# EAGLE design ftcontrol (EAGLE 6.4)
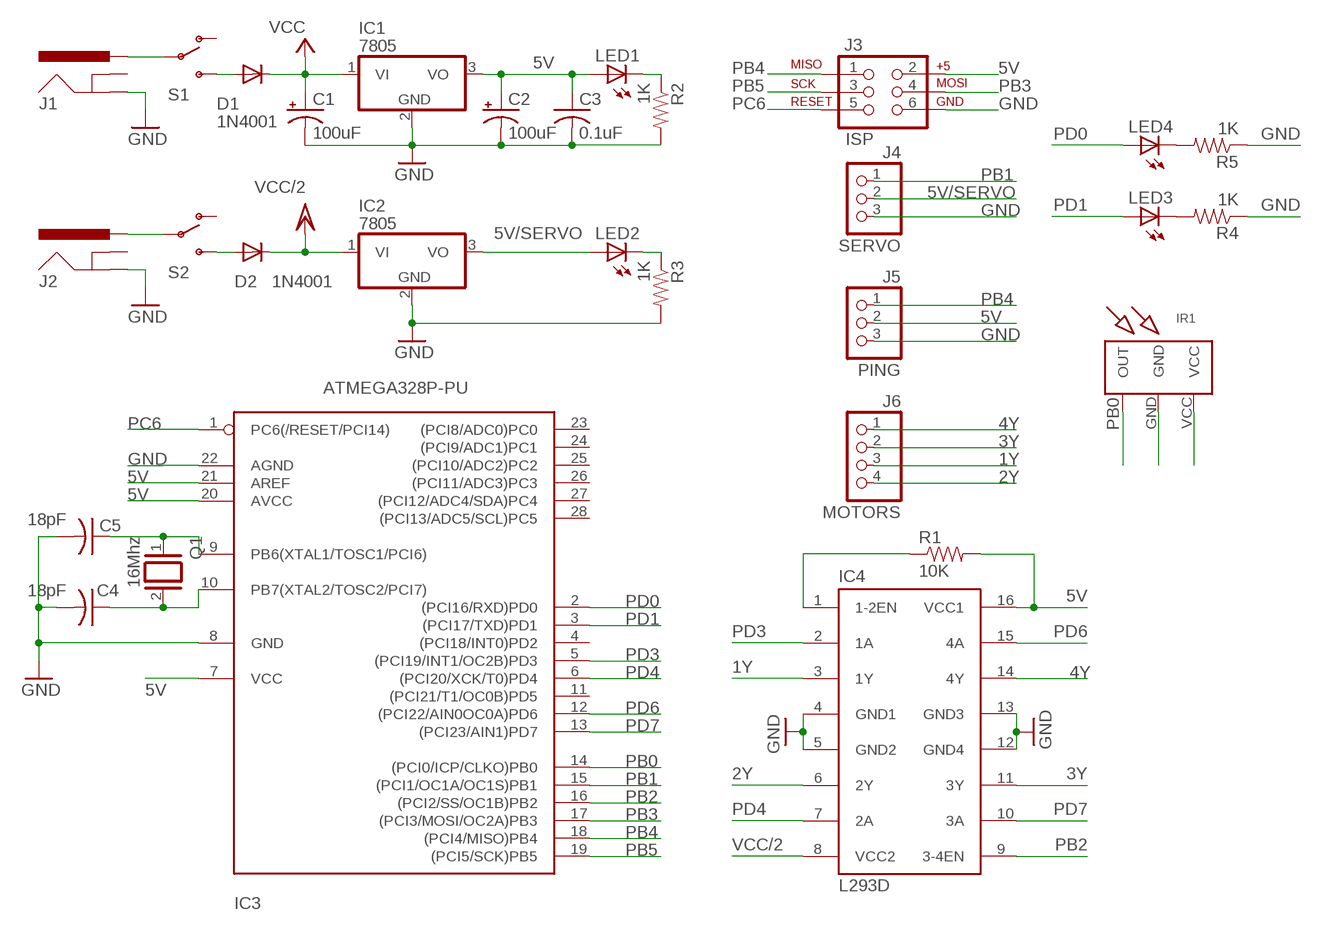
[diagram p0: schematic, sheet 1]

## Parts
C1  100uF  CAP_POLPTH1  [CPOL-RADIAL-100UF-25V]
C2  100uF  CAP_POLPTH2  [CPOL-RADIAL-10UF-25V]
C3  0.1uF  C-US025-025X050  [C025-025X050]
C4  18pF  C-US025-025X050  [C025-025X050]
C5  18pF  C-US025-025X050  [C025-025X050]
D1  1N4001  DIODEPTH  [DIODE-1N4001]
D2  1N4001  DIODEPTH  [DIODE-1N4001]
IC1  7805  7805TV  [TO220V]
IC2  7805  7805TV  [TO220V]
IC3  ATMEGA328P-PU  ATMEGA168-20P  [DIL28-3]
IC4  L293D  [DIL16]
IR1  IR_TSOP4838  [TSOP_4838]
J1  POWER_JACKPTH  [POWER_JACK_PTH]
J2  POWER_JACKPTH  [POWER_JACK_PTH]
J3  ISP  AVR_SPI_PRG_6PTH  [2X3]
J4  SERVO  PINHD-1X3  [1X03]
J5  PING  PINHD-1X3  [1X03]
J6  MOTORS  PINHD-1X4  [1X04]
LED1  LED3MM  [LED3MM]
LED2  LED3MM  [LED3MM]
LED3  LED3MM  [LED3MM]
LED4  LED3MM  [LED3MM]
Q1  16Mhz  XTAL/S  [QS]
R1  10K  RESISTORPTH-1/4W  [AXIAL-0.4]
R2  1K  RESISTORPTH-1/4W  [AXIAL-0.4]
R3  1K  RESISTORPTH-1/4W  [AXIAL-0.4]
R4  1K  RESISTORPTH-1/4W  [AXIAL-0.4]
R5  1K  RESISTORPTH-1/4W  [AXIAL-0.4]
S1  SWITCH-SPDTPTH  [SWITCH-SPDT]
S2  SWITCH-SPDTPTH  [SWITCH-SPDT]

## Nets
1Y: IC4.3(1Y) J6.3
2Y: IC4.6(2Y) J6.4
3Y: IC4.11(3Y) J6.2
4Y: IC4.14(4Y) J6.1
5V: C2.1(+) C3.1 IC1.3(VO) IC3.7(VCC) IC3.20(AVCC) IC3.21(AREF) IC4.16(VCC1) IR1.VCC J3.2 J5.2 LED1.A R1.P$2
5V/SERVO: IC2.3(VO) J4.2 LED2.A
GND: C1.2(-) C2.2(-) C3.2 C4.2 C5.2 IC1.2(GND) IC2.2(GND) IC3.8(GND) IC3.22(AGND) IC4.4(GND1) IC4.5(GND2) IC4.12(GND4) IC4.13(GND3) IR1.GND J1.GND J2.GND J3.6 J4.3 J5.3 R2.P$2 R3.P$2 R4.P$1 R5.P$1
N$1: LED1.K(C) R2.P$1
N$3: D1.A S1.3(S)
N$4: LED3.K(C) R4.P$2
N$5: J2.PWR S2.2(P)
N$6: IC4.1(1-2EN) R1.P$1
N$7: LED2.K(C) R3.P$1
N$8: D2.A S2.3(S)
N$9: LED4.K(C) R5.P$2
N$11: C5.1 IC3.9(PB6(XTAL1/TOSC1/PCI6)) Q1.1
N$12: C4.1 IC3.10(PB7(XTAL2/TOSC2/PCI7)) Q1.2
N$13: J1.PWR S1.2(P)
PB0: IC3.14((PCI0/ICP/CLKO)PB0) IR1.OUT
PB1: IC3.15((PCI1/OC1A/OC1S)PB1) J4.1
PB2: IC3.16((PCI2/SS/OC1B)PB2) IC4.9(3-4EN)
PB3: IC3.17((PCI3/MOSI/OC2A)PB3) J3.4
PB4: IC3.18((PCI4/MISO)PB4) J3.1 J5.1
PB5: IC3.19((PCI5/SCK)PB5) J3.3
PC6: IC3.1(PC6(/RESET/PCI14)) J3.5
PD0: IC3.2((PCI16/RXD)PD0) LED4.A
PD1: IC3.3((PCI17/TXD)PD1) LED3.A
PD3: IC3.5((PCI19/INT1/OC2B)PD3) IC4.2(1A)
PD4: IC3.6((PCI20/XCK/T0)PD4) IC4.7(2A)
PD6: IC3.12((PCI22/AIN0OC0A)PD6) IC4.15(4A)
PD7: IC3.13((PCI23/AIN1)PD7) IC4.10(3A)
VCC: C1.1(+) D1.C IC1.1(VI)
VCC/2: D2.C IC2.1(VI) IC4.8(VCC2)
Unconnected: IC3.4((PCI18/INT0)PD2) IC3.11((PCI21/T1/OC0B)PD5) IC3.23((PCI8/ADC0)PC0) IC3.24((PCI9/ADC1)PC1) IC3.25((PCI10/ADC2)PC2) IC3.26((PCI11/ADC3)PC3) IC3.27((PCI12/ADC4/SDA)PC4) IC3.28((PCI13/ADC5/SCL)PC5) J1.GNDBREAK J2.GNDBREAK S1.1(O) S2.1(O)

## Library data of the parts
C1 C2 = SparkFun-Passives:CAP_POL: Capacitor Polarized These are standard SMD and PTH capacitors. Normally 10uF, 47uF, and 100uF in electrolytic and tantalum varieties. Always verify the external diameter of the through hole cap, it varies with capacity, voltage, and manufacturer. The EIA devices should be standard.
C3-C5 = rcl:C-US: CAPACITOR, American symbol
D1 D2 = SparkFun-DiscreteSemi:DIODE: Diode These are standard reverse protection diodes and small signal diodes. SMA package can handle up to about 1A. SOD-323 can handle about 200mA. What the SOD-323 package when ordering, there are some mfgs out there that are 5-pin packages.
IC1 IC2 = linear:78*: Positive VOLTAGE REGULATOR Source: http://cache.national.com/ds/LM/LM78L05.pdf http://www.fairchildsemi.com/ds/LM/LM7805.pdf
IC3 = adafruit:ATMEGA168*P: MICROCONTROLLER 16 kBytes FLASH 1 kBytes SRAM 512 Bytes EEPROM USART 8-channel 10 bit ADC
IC4 = st-microelectronics:L293D: PUSH-PULL 4 CHANNEL DRIVER; MPN: L293D; OC_FARNELL: 9589619; OC_NEWARK: 56P8249
IR1 = ubiyubix:IR_TSOP4838: IR Receiver and Decoder TSOP4838
J1 J2 = SparkFun-Connectors:POWER_JACK: Power Jack This is the standard 5.5mm barrel jack for power. The PTH is the most common, proven, reliable, footprint. All others are experimental. The Slot footprint only works if the mill layer is transmitted to the PCB fab house so be warned. Spark Fun Electronics SKU : PRT-00119. Mating wall wart : TOL-00298 (and others)
J3 = SparkFun-Connectors:AVR_SPI_PRG_6: AVR ISP 6 Pin This is the reduced ISP connector for AVR programming. Common on Arduino. This footprint will take up less PCB space and can be used with a 10-pin to 6-pin adapter such as SKU: BOB-08508
J4 J5 = adafruit:PINHD-1X3: PIN HEADER
J6 = pinhead:PINHD-1X4: PIN HEADER
LED1-LED4 = adafruit:LED: LED OSRAM: - CHIPLED LG R971, LG N971, LY N971, LG Q971, LY Q971, LO R971, LY R971 LH N974, LH R974 LS Q976, LO Q976, LY Q976 LO Q996 - Hyper CHIPLED LW Q18S LB Q993, LB Q99A, LB R99A - SideLED LS A670, LO A670, LY A670, LG A670, LP A670 LB A673, LV A673, LT A673, LW A673 LH A674 LY A675 LS A676, LA A676, LO A676, LY A676, LW A676 LS A679, LY A679, LG A679 - Hyper Micro SIDELED® LS Y876, LA Y876, LO Y876, LY Y876 LT Y87S - SmartLED LW L88C, LW L88S LB L89C, LB L89S, LG L890 LS L89K, LO L89K, LY L89K LS L896, LA L896, LO L896, LY L896 - TOPLED LS T670, LO T670, LY T670, LG T670, LP T670 LSG T670, LSP T670, LSY T670, LOP T670, LYG T670 LG T671, LOG T671, LSG T671 LB T673, LV T673, LT T673, LW T673 LH T674 LS T676, LA T676, LO T676, LY T676, LB T676, LH T676, LSB T676, LW T676 LB T67C, LV T67C, LT T67C, LS T67K, LO T67K, LY T67K, LW E67C LS E67B, LA E67B, LO E67B, LY E67B, LB E67C, LV E67C, LT E67C LW T67C LS T679, LY T679, LG T679 LS T770, LO T770, LY T770, LG T770, LP T770 LB T773, LV T773, LT T773, LW T773 LH T774 LS E675, LA E675, LY E675, LS T675 LS T776, LA T776, LO T776, LY T776, LB T776 LHGB T686 LT T68C, LB T68C - Hyper Mini TOPLED® LB M676 - Mini TOPLED Santana® LG M470 LS M47K, LO M47K, LY M47K Source: http://www.osram.convergy.de/
Q1 = SmartPrj:XTAL/S: CRYSTAL
R1-R5 = SparkFun-Resistors:RESISTOR: Resistor Basic schematic elements and footprints for 0603, 1206, and PTH resistors.
S1 S2 = SparkFun-Electromechanical:SWITCH-SPDT: SPST Switch Simple slide switch. Spark Fun Electronics SKU : COM-00102

## Board
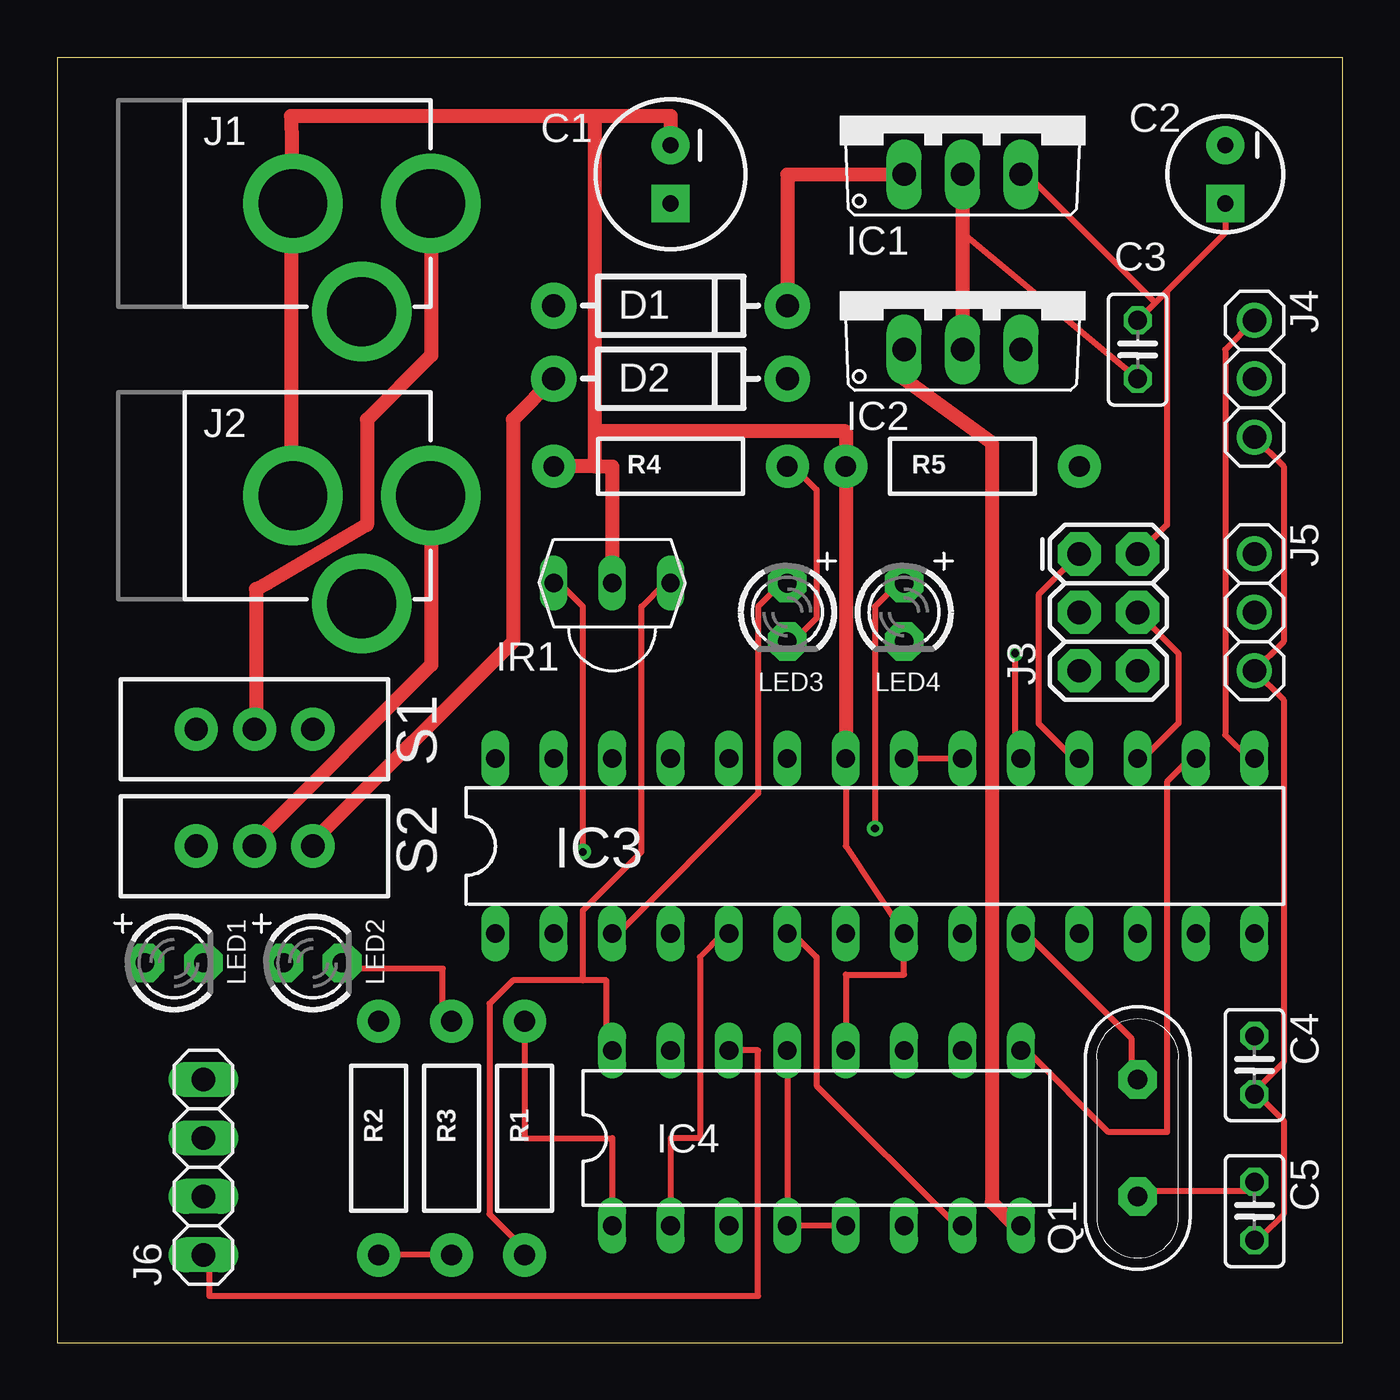
[diagram p1: board, top side]
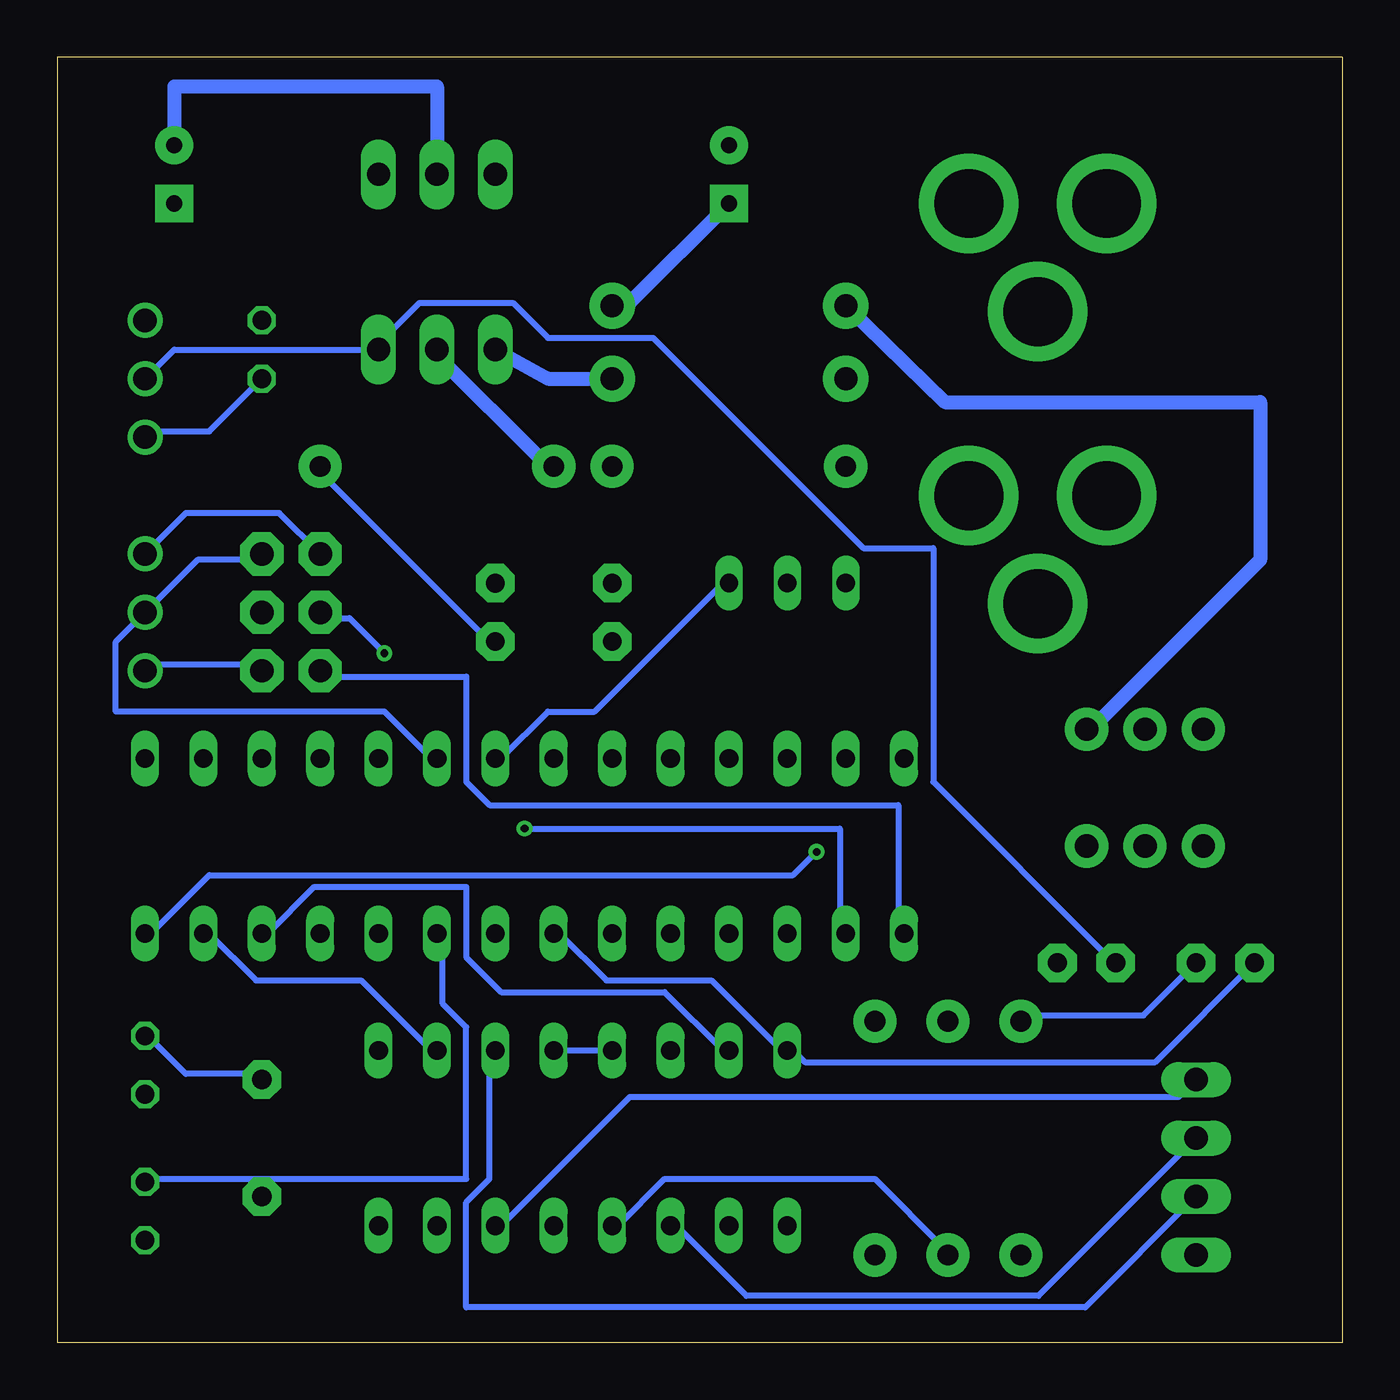
[diagram p2: board, bottom side, seen from below]

Size 55.88 x 55.88 mm. Coordinates in mm from the lower left corner, seen from the top.
Outline: 0,55.88 0,0 55.88,0 55.88,55.88 0,55.88
Copper layers (1*16): Top 0.0356mm / dielectric 1.5011mm / Bottom 0.0356mm
Design rules "LaenPCBOrder *": minimum track width 10mil, minimum drill 13mil, track to track 10mil, track to pad 10mil, pad to pad 10mil, via to via 10mil, smd to smd 10mil, copper to edge 15mil, drill to drill 6mil, minimum pad ring 7mil, minimum via ring 7mil, stop-mask expansion 4mil, vias tented up to drill 0mil, thermal gap 10mil

### Footprints (pad centres in the part's own frame; a part is rotated, then mirrored left to right if it is on the bottom)
CPOL-RADIAL-100UF-25V = drill 0.7 pad 1.651 square: 1 1.27,0 | drill 0.7 pad 1.651: 2 -1.27,0
CPOL-RADIAL-10UF-25V = drill 0.7 pad 1.651 square: 1 1.27,0 | drill 0.7 pad 1.651: 2 -1.27,0
C025-025X050 = drill 0.813 octagon: 1 -1.27,0; 2 1.27,0
DIODE-1N4001 = drill 1 pad 1.981: A -5.08,0; C 5.08,0
TO220V = drill 1.016 long: 1 -2.54,-2.54; 2 0,-2.54; 3 2.54,-2.54
DIL28-3 = drill 0.813 long: 1 -16.51,-3.81; 2 -13.97,-3.81; 3 -11.43,-3.81; 4 -8.89,-3.81; 5 -6.35,-3.81; 6 -3.81,-3.81; 7 -1.27,-3.81; 8 1.27,-3.81; 9 3.81,-3.81; 10 6.35,-3.81; 11 8.89,-3.81; 12 11.43,-3.81; 13 13.97,-3.81; 14 16.51,-3.81; 15 16.51,3.81; 16 13.97,3.81; 17 11.43,3.81; 18 8.89,3.81; 19 6.35,3.81; 20 3.81,3.81; 21 1.27,3.81; 22 -1.27,3.81; 23 -3.81,3.81; 24 -6.35,3.81; 25 -8.89,3.81; 26 -11.43,3.81; 27 -13.97,3.81; 28 -16.51,3.81
DIL16 = drill 0.813 long: 1 -8.89,-3.81; 2 -6.35,-3.81; 3 -3.81,-3.81; 4 -1.27,-3.81; 5 1.27,-3.81; 6 3.81,-3.81; 7 6.35,-3.81; 8 8.89,-3.81; 9 8.89,3.81; 10 6.35,3.81; 11 3.81,3.81; 12 1.27,3.81; 13 -1.27,3.81; 14 -3.81,3.81; 15 -6.35,3.81; 16 -8.89,3.81
TSOP_4838 = drill 0.8 long: GND 0,0; OUT -2.54,0; VCC 2.54,0
POWER_JACK_PTH = drill 2.997 pad 4.318: GND 0,7.7; GNDBREAK 4.7,10.7; PWR 0,13.7
2X3 = drill 1.016 pad 1.88 octagon: 1 0,0; 2 0,2.54; 3 2.54,0; 4 2.54,2.54; 5 5.08,0; 6 5.08,2.54
1X03 = drill 1.016: 1 -2.54,0; 2 0,0; 3 2.54,0
1X04 = drill 1.016 long: 1 -3.81,0; 2 -1.27,0; 3 1.27,0; 4 3.81,0
LED3MM = drill 0.813 pad 1.676 octagon: A -1.27,0; K 1.27,0
QS = drill 0.85 pad 1.676 octagon: 1 -2.54,0; 2 2.54,0
AXIAL-0.4 = drill 0.9 pad 1.88: P$1 -5.08,0; P$2 5.08,0
SWITCH-SPDT = drill 1.016 pad 1.88: 1 0,2.54; 2 0,0; 3 0,-2.54

### Placement (x,y rotation side)
C1  26.67,50.8 270 top
C2  50.8,50.8 270 top
C3  46.99,43.18 270 top
C4  52.07,12.06 270 top
C5  52.07,5.71 270 top
D1  26.67,45.08 0 top
D2  26.67,41.91 0 top
IC1  39.37,53.34 0 top
IC2  39.37,45.72 0 top
IC3  35.56,21.59 0 top
IC4  33.02,8.89 0 top
IR1  24.13,33.02 0 top
J1  2.54,49.53 270 top
J2  2.54,36.83 270 top
J3  44.45,34.29 270 top
J4  52.07,41.91 270 top
J5  52.07,31.75 270 top
J6  6.35,7.62 90 top
LED1  5.08,16.51 0 top
LED2  11.11,16.51 0 top
LED3  31.75,31.75 270 top
LED4  36.83,31.75 270 top
Q1  46.99,8.89 90 top
R1  20.32,8.89 270 top
R2  13.97,8.89 270 top
R3  17.14,8.89 270 top
R4  26.67,38.1 0 top
R5  39.37,38.1 0 top
S1  8.57,26.67 90 top
S2  8.57,21.59 90 top

### Tracks (layer width: path | path; a pad name or v marks a point on that pad's centre or on a via)
1Y
  Bottom 0.254: J6.3 13.21,2.03 25.91,2.03 28.96,5.08 IC4.3
2Y
  Bottom 0.254: J6.4 7.11,10.67 30.99,10.67 36.58,5.08 IC4.6
3Y
  Bottom 0.254: J6.2 11.18,1.52 38.1,1.52 38.1,6.1 37.08,7.11 37.08,12.7 IC4.11
4Y
  Top 0.254: IC4.14 30.48,12.7 30.48,2.03 6.6,2.03 6.6,3.56 J6.1
5V
  Top 0.254: 48.26,45.72 50.8,48.26 C2.1 | 48.26,45.72 47.75,45.21 | 47.75,45.21 C3.1 | 47.75,45.21 42.16,50.8 IC1.3 | J3.2 48.26,35.56 48.26,45.72 | IC3.21 IC3.20 | 22.86,15.75 23.88,15.75 23.88,12.7 IC4.16 | 22.86,15.75 19.81,15.75 18.8,14.73 18.8,5.59 20.32,4.06 R1.P$2 | 22.86,15.75 22.86,18.8 25.4,21.34 25.4,32 26.42,33.02 IR1.VCC
  Bottom 0.254: J3.2 47.24,34.04 49.78,34.04 J5.2 53.34,30.48 53.34,27.43 41.66,27.43 39.62,25.4 IC3.20 | IR1.VCC 26.92,33.02 32.51,27.43 34.54,27.43 36.58,25.4 IC3.21 | IC3.7 34.04,17.78 32,15.75 27.43,15.75 24.38,12.7 IC4.16 23.88,12.7 23.37,12.19 8.13,12.19 LED1.A
5V/SERVO
  Bottom 0.254: 42.16,43.18 50.8,43.18 J4.2 | 42.16,43.18 40.13,45.21 36.07,45.21 34.54,43.69 29.97,43.69 20.83,34.54 17.78,34.54 17.78,24.38 10.16,16.76 LED2.A | 42.16,43.18 IC2.3
GND
  Top 0.254: 10.16,37.08 J2.GND | 10.16,49.28 J1.GND | R3.P$2 R2.P$2 | IC4.5 IC4.4 IC4.13 | IC4.12 34.29,16 36.83,16 IC3.8 34.29,21.59 IC3.22 | C5.2 52.32,4.57 53.34,5.59 53.34,9.65 52.32,10.67 C4.2 52.32,11.18 53.34,12.19 53.34,27.94 J5.3 53.34,30.48 53.34,38.1 J4.3 | 39.37,48.26 C3.2
  Top 0.61: 23.37,38.1 24.13,38.1 IR1.GND | 23.37,53.34 10.16,53.34 J1.GND | 23.37,53.34 26.67,53.34 C1.2 | 23.37,39.62 23.37,38.1 | 23.37,53.34 23.37,39.62 | 23.37,38.1 R4.P$1 | 10.16,49.28 10.16,37.08 | IC3.22 R5.P$1 34.29,39.62 23.37,39.62 | IC1.2 39.37,48.26 IC2.2
  Bottom 0.254: IC4.12 IC4.13 | R3.P$2 17.27,4.06 20.32,7.11 29.46,7.11 31.5,5.08 IC4.4 | J5.3 51.82,29.46 47.24,29.46 J3.6 | C3.2 49.28,39.62 51.82,39.62 J4.3 | 34.54,38.1 R5.P$1 | 39.62,43.18 IC2.2
  Bottom 0.61: C2.2 50.8,54.61 39.37,54.61 IC1.2 | 39.62,43.18 34.54,38.1
N$1
  Bottom 0.254: LED1.K 8.64,14.22 13.72,14.22 R2.P$1
N$3
  Bottom 0.61: D1.A 17.27,40.89 3.56,40.89 3.56,34.04 10.67,26.92 S1.3
N$4
  Top 0.254: LED3.K 32,30.48 33.02,31.5 33.02,37.08 32,38.1 R4.P$2
N$5
  Top 0.254: 8.64,21.84 S2.2 | 16.26,36.58 J2.PWR
  Top 0.61: 8.64,21.84 16.26,29.46 16.26,36.58
N$6
  Top 0.254: R1.P$1 20.32,8.89 24.13,8.89 IC4.1
N$7
  Top 0.254: LED2.K 12.7,16.26 16.76,16.26 16.76,14.22 R3.P$1
N$8
  Top 0.61: D2.A 19.81,40.13 19.81,30.48 11.18,21.84 S2.3
N$9
  Bottom 0.254: LED4.K 37.08,30.48 44.7,38.1 R5.P$2
N$11
  Top 0.254: C5.1 51.82,6.6 47.24,6.6 Q1.1
  Bottom 0.254: IC3.9 39.12,17.78 39.12,14.73 38.1,13.72 38.1,7.11 51.82,7.11 C5.1
N$12
  Top 0.254: IC3.10 42.16,17.78 46.74,13.21 46.74,11.68 Q1.2
  Bottom 0.254: C4.1 51.82,13.21 50.29,11.68 47.24,11.68 Q1.2
N$13
  Top 0.61: S1.2 8.64,26.92 8.64,32.77 9.14,33.02 13.46,35.56 13.46,40.13 16.26,42.93 16.26,49.28 J1.PWR
PB0  (via drill 0.33)
  Top 0.254: v22.86,21.34 22.86,32 21.84,33.02 IR1.OUT
  Bottom 0.254: v22.86,21.34 23.88,20.32 49.28,20.32 51.82,17.78 IC3.14
PB1
  Top 0.254: J4.1 50.8,43.18 50.8,26.42 51.82,25.4 IC3.15
PB2
  Top 0.254: IC4.9 42.16,12.7 45.72,9.14 48.26,9.14 48.26,24.38 49.28,25.4 IC3.16
PB3
  Top 0.254: J3.4 48.77,29.97 48.77,26.92 47.24,25.4 IC3.17
PB4
  Top 0.254: J3.1 42.67,32.51 42.67,26.92 44.2,25.4 IC3.18
  Bottom 0.254: J5.1 50.29,36.07 46.23,36.07 J3.1
PB5  (via drill 0.33)
  Top 0.254: v41.66,29.97 41.66,25.4 IC3.19
  Bottom 0.254: v41.66,29.97 43.18,31.5 44.2,31.5 J3.3
PC6
  Bottom 0.254: IC3.1 19.3,17.78 19.3,23.37 37.08,23.37 38.1,24.38 38.1,28.96 44.2,28.96 J3.5
PD0  (via drill 0.33)
  Top 0.254: v35.56,22.35 35.56,32 36.58,33.02 LED4.A
  Bottom 0.254: v35.56,22.35 21.84,22.35 21.84,17.78 IC3.2
PD1
  Top 0.254: IC3.3 24.38,17.78 30.48,23.88 30.48,32 31.5,33.02 LED3.A
PD3
  Top 0.254: IC4.2 26.67,8.89 27.94,8.89 27.94,16.76 28.96,17.78 IC3.5
PD4
  Top 0.254: IC4.7 39.12,5.08 33.02,11.18 33.02,16.76 32,17.78 IC3.6
PD6
  Bottom 0.254: IC4.15 26.92,12.7 29.46,15.24 36.58,15.24 38.1,16.76 38.1,19.81 44.7,19.81 46.74,17.78 IC3.12
PD7
  Bottom 0.254: IC4.10 39.62,12.7 42.67,15.75 47.24,15.75 49.28,17.78 IC3.13
VCC
  Top 0.61: IC1.1 36.58,50.8 31.75,50.8 D1.C
  Bottom 0.61: C1.1 30.99,45.21 31.75,45.21 D1.C
VCC/2
  Top 0.254: 41.66,5.08 IC4.8
  Top 0.61: 41.66,5.08 40.64,6.1 40.64,39.12 36.83,41.91 IC2.1
  Bottom 0.61: D2.C 34.54,41.91 IC2.1

### Text on the board
_tsilk: C2 | J1 | C1 | IC1 | C3 | SERVO | J4 | D1 | D2 | IC2 | J2 | R4 | R5 | ISP | PING | J5 | J3 | IR1 | LED3 | LED4 | S1 | ATMEGA328P-PU | S2 | IC3 | LED1 | LED2 | C4 | R2 | R3 | R1 | IC4 | L293D | C5 | Q1 | J6 | MOTORS